# EAGLE design untitled (EAGLE 7.6.0)
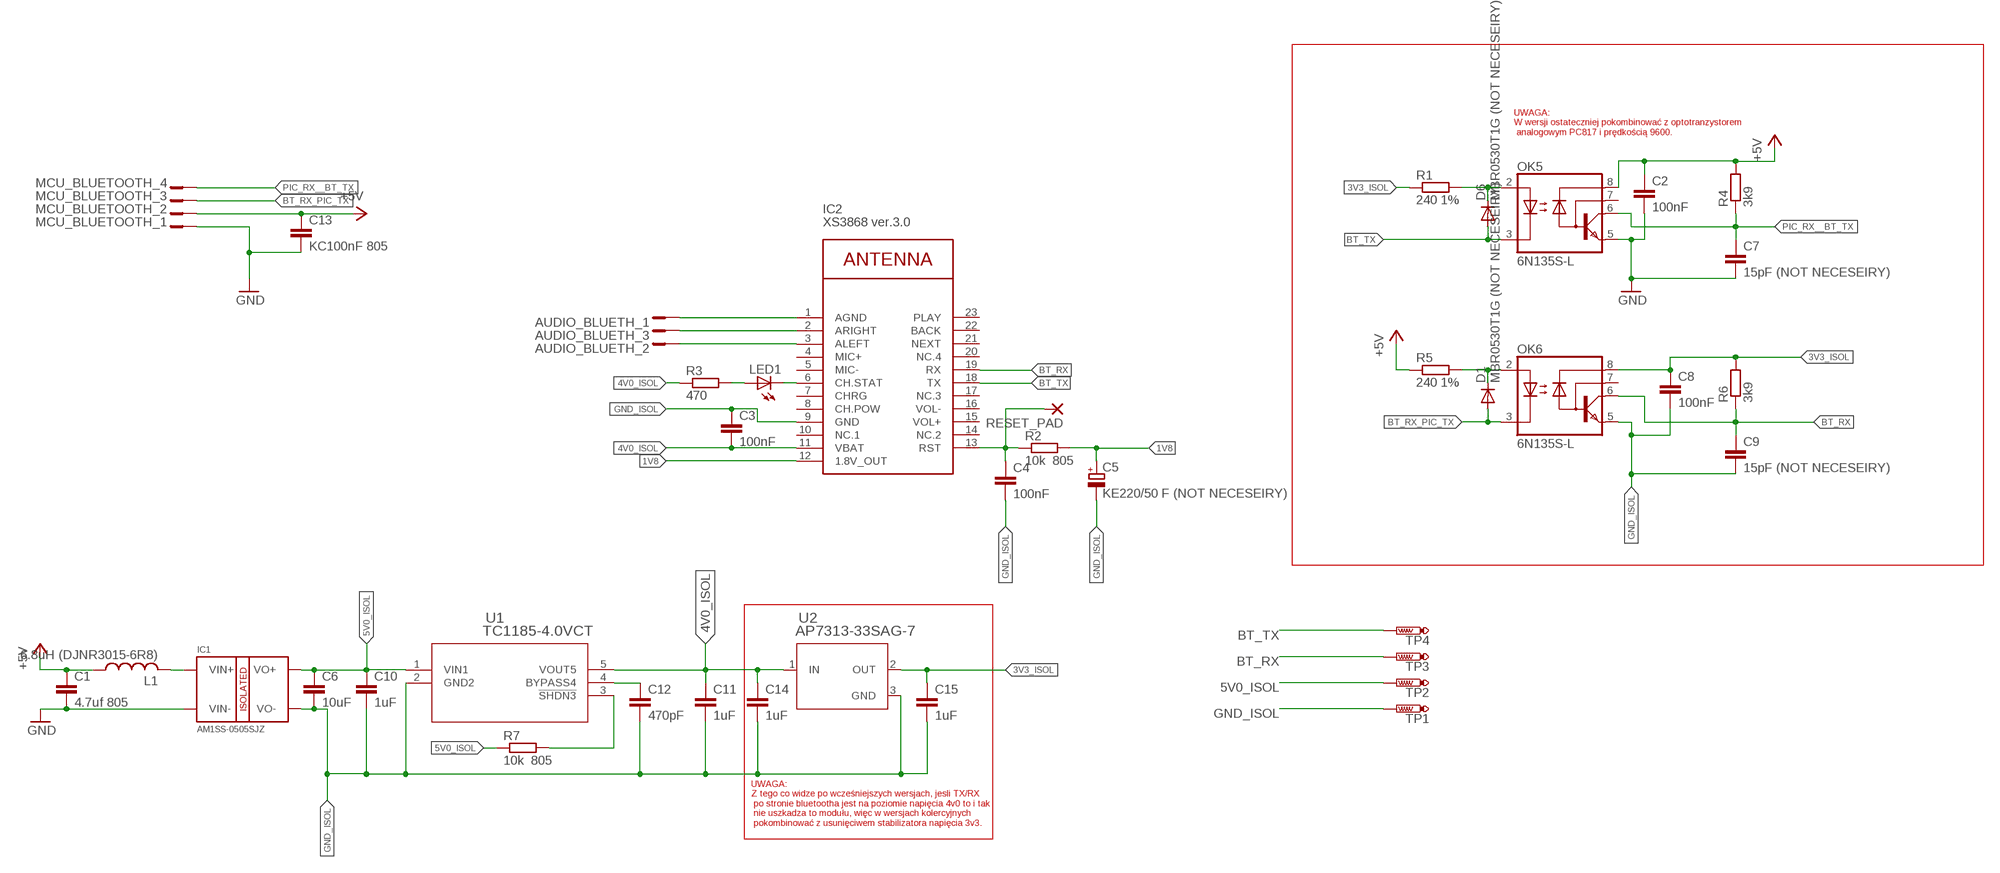
[diagram p0: schematic, sheet 1, part 1 of 2]
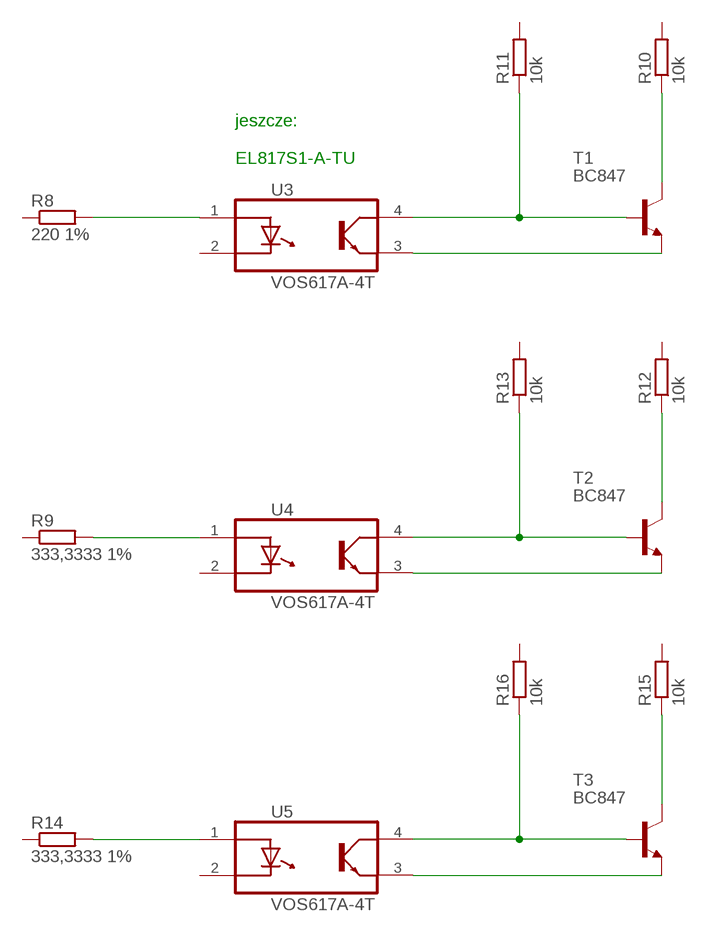
[diagram p1: schematic, sheet 1, part 2 of 2]

## Parts
AUDIO_BLUETH  JST_3_PIN_B3B-PH-KS  [B3B-PH-KS]
C1  4.7uf 805  C-EUC0805  [C0805]
C2  100nF  C-EUC0805  [C0805]
C3  100nF  C-EUC0805  [C0805]
C4  100nF  C-EUC0805  [C0805]
C5  KE220/50 F (NOT NECESEIRY)  CPOL-EUG  [PANASONIC_G]
C6  10uF  C-EUC0805  [C0805]
C7  15pF (NOT NECESEIRY)  C-EUC0805  [C0805]
C8  100nF  C-EUC0805  [C0805]
C9  15pF (NOT NECESEIRY)  C-EUC0805  [C0805]
C10  1uF  C-EUC0805  [C0805]
C11  1uF  C-EUC0805  [C0805]
C12  470pF  C-EUC0805  [C0805]
C13  KC100nF 805  C-EUC0805  [C0805]
C14  1uF  C-EUC0805  [C0805]
C15  1uF  C-EUC0805  [C0805]
D1  MBR0530T1G (NOT NECESEIRY)  MBR0520LT  [SOD123]
D6  MBR0530T1G (NOT NECESEIRY)  MBR0520LT  [SOD123]
IC1  AM1SS-0505SJZ  AM1SS-0503S-NZ  [SIP4]
IC2  XS3868 ver.3.0  WIRELESS-BLUETOOTH-XS3868  [WIRELESS-BLUETOOTH-XS3868]
L1  6.8uH (DJNR3015-6R8)  L-USL3230M  [L3230M]
LED1  LEDSMART-LED  [SMART-LED]
MCU_BLUETOOTH  JST_4_PIN_B4B-PH-KS  [B4B-PH-KS]
OK5  6N135S-L  6N135DIL8-SMD  [DIL8-SMD]
OK6  6N135S-L  6N135DIL8-SMD  [DIL8-SMD]
R1  240 1%  R-EU_M0805  [M0805]
R2  10k 805  R-EU_M0805  [M0805]
R3  470  R-EU_M0805  [M0805]
R4  3k9  R-EU_M0805  [M0805]
R5  240 1%  R-EU_M0805  [M0805]
R6  3k9  R-EU_M0805  [M0805]
R7  10k 805  R-EU_M0805  [M0805]
R8  220 1%  R-EU_M0805  [M0805]
R9  333,3333 1%  R-EU_M0805  [M0805]
R10  10k  R-EU_M0805  [M0805]
R11  10k  R-EU_M0805  [M0805]
R12  10k  R-EU_M0805  [M0805]
R13  10k  R-EU_M0805  [M0805]
R14  333,3333 1%  R-EU_M0805  [M0805]
R15  10k  R-EU_M0805  [M0805]
R16  10k  R-EU_M0805  [M0805]
RESET_PAD  SMD2  [SMD1,27-2,54]
T1  BC847  [SOT23]
T2  BC847  [SOT23]
T3  BC847  [SOT23]
TP1  PTR1B1,27  [B1,27]
TP2  PTR1B1,27  [B1,27]
TP3  PTR1B1,27  [B1,27]
TP4  PTR1B1,27  [B1,27]
U1  TC1185-4.0VCT  TC1185-X.XXCT713SOT-23-5_MC-M  [SOT-23-5_MC-M]
U2  AP7313-33SAG-7  [SOT-23]
U3  VOS617A-4T  [SOIC127P700X210-4N]
U4  VOS617A-4T  [SOIC127P700X210-4N]
U5  VOS617A-4T  [SOIC127P700X210-4N]

## Nets
1V8: C5.+ IC2.12(1.8V_OUT) R2.2
3V3_ISOL: C8.1 C15.1 OK6.8(VCC) R1.1 R6.2 U2.2(OUT)
4V0_ISOL: C3.2 C11.1 C14.1 IC2.11(VBAT) R3.1 U1.5(VOUT5) U2.1(IN)
5V0_ISOL: C6.1 C10.1 IC1.P$4(VO+) R7.1 TP2.TP U1.1(VIN1)
+5V: C1.1 C2.1 C13.1 L1.1 MCU_BLUETOOTH.P$2 OK5.8(VCC) R4.2 R5.1
AGND: AUDIO_BLUETH.P$1 IC2.1(AGND)
BT_LED: IC2.6(CH.STAT) LED1.B(C)
BT_RX: C9.1 IC2.19(RX) OK6.6(VO) R6.1 TP3.TP
BT_RX_PIC_TX: D1.A MCU_BLUETOOTH.P$3 OK6.3(C)
BT_TX: D6.A IC2.18(TX) OK5.3(C) TP4.TP
BTOUT_LEFT: AUDIO_BLUETH.P$2 IC2.3(ALEFT)
BTOUT_RIGHT: AUDIO_BLUETH.P$3 IC2.2(ARIGHT)
GND: C1.2 C2.2 C7.2 C13.2 IC1.P$1(VIN-) MCU_BLUETOOTH.P$1 OK5.5(GND)
GND_ISOL: C3.1 C4.2 C5.- C6.2 C8.2 C9.2 C10.2 C11.2 C12.2 C14.2 C15.2 IC1.P$3(VO-) IC2.9(GND) OK6.5(GND) TP1.TP U1.2(GND2) U2.3(GND)
N$1: IC1.P$2(VIN+) L1.2
N$2: D6.C OK5.2(A) R1.2
N$3: D1.C OK6.2(A) R5.2
N$4: C12.1 U1.4(BYPASS4)
N$5: LED1.A R3.2
N$6: R7.2 U1.3(!SHDN3)
N$7: R8.2 U3.1(A)
N$8: R9.2 U4.1(A)
N$9: R10.1 T1.3(C)
N$10: R11.1 T1.1(B) U3.4(CO)
N$11: T1.2(E) U3.3(E)
N$12: R12.1 T2.3(C)
N$13: R13.1 T2.1(B) U4.4(CO)
N$14: T2.2(E) U4.3(E)
N$15: R14.2 U5.1(A)
N$16: R15.1 T3.3(C)
N$17: R16.1 T3.1(B) U5.4(CO)
N$18: T3.2(E) U5.3(E)
PIC_RX__BT_TX: C7.1 MCU_BLUETOOTH.P$4 OK5.6(VO) R4.1
RST: C4.1 IC2.13(RST) R2.1 RESET_PAD.1(P)
Unconnected: IC2.4(MIC+) IC2.5(MIC-) IC2.7(CHRG) IC2.8(CH.POW) IC2.10(NC.1) IC2.14(NC.2) IC2.15(VOL+) IC2.16(VOL-) IC2.17(NC.3) IC2.20(NC.4) IC2.21(NEXT) IC2.22(BACK) IC2.23(PLAY) OK5.7(VB) OK6.7(VB) R8.1 R9.1 R10.2 R11.2 R12.2 R13.2 R14.1 R15.2 R16.2 U3.2(C) U4.2(C) U5.2(C)

## Notes on the sheet
- jeszcze:
  
  EL817S1-A-TU
- UWAGA:
  W wersji ostateczniej pokombinować z optotranzystorem
   analogowym PC817 i prędkością 9600.
- UWAGA:
  Z tego co widze po wcześniejszych wersjach, jesli TX/RX
   po stronie bluetootha jest na poziomie napięcia 4v0 to i tak
   nie uszkadza to modułu, więc w wersjach kolercyjnych
   pokombinować z usunięciwem stabilizatora napięcia 3v3.

## Library data of the parts
AUDIO_BLUETH = conn-JST:JST_3_PIN_
C1 C13 = rcl:C-EU: CAPACITOR, European symbol
C2-C4 C6-C12 C14 C15 = resistor:C-EU: CAPACITOR, European symbol
C5 = rcl:CPOL-EU: POLARIZED CAPACITOR, European symbol
D1 D6 = diode:MBR0520LT: SCHOTTKY BARRIER RECTIFIER Source: http://onsemi.com .. MBR0520LT1-D.pdf
IC1 = DC-DC_converter:AM1SS
IC2 = diy-modules:WIRELESS-BLUETOOTH-XS3868: Bluetooth Stereo Audio Module based on OVC3860 chip More details available here: http://artofcircuits.com/product/bluetooth-2-0-edr-stereo-audio-ovc3860-module-model-xs-3868 Click here to find device on ebay.com <http://www.ebay.com/sch/xs3868+bluetooth+audio+module>
L1 = rcl:L-US: INDUCTOR, American symbol
LED1 = led:LED: LED OSRAM: - CHIPLED LG R971, LG N971, LY N971, LG Q971, LY Q971, LO R971, LY R971 LH N974, LH R974 LS Q976, LO Q976, LY Q976 LO Q996 - Hyper CHIPLED LW Q18S LB Q993, LB Q99A, LB R99A - SideLED LS A670, LO A670, LY A670, LG A670, LP A670 LB A673, LV A673, LT A673, LW A673 LH A674 LY A675 LS A676, LA A676, LO A676, LY A676, LW A676 LS A679, LY A679, LG A679 - Hyper Micro SIDELED® LS Y876, LA Y876, LO Y876, LY Y876 LT Y87S - SmartLED LW L88C, LW L88S LB L89C, LB L89S, LG L890 LS L89K, LO L89K, LY L89K LS L896, LA L896, LO L896, LY L896 - TOPLED LS T670, LO T670, LY T670, LG T670, LP T670 LSG T670, LSP T670, LSY T670, LOP T670, LYG T670 LG T671, LOG T671, LSG T671 LB T673, LV T673, LT T673, LW T673 LH T674 LS T676, LA T676, LO T676, LY T676, LB T676, LH T676, LSB T676, LW T676 LB T67C, LV T67C, LT T67C, LS T67K, LO T67K, LY T67K, LW E67C LS E67B, LA E67B, LO E67B, LY E67B, LB E67C, LV E67C, LT E67C LW T67C LS T679, LY T679, LG T679 LS T770, LO T770, LY T770, LG T770, LP T770 LB T773, LV T773, LT T773, LW T773 LH T774 LS E675, LA E675, LY E675, LS T675 LS T776, LA T776, LO T776, LY T776, LB T776 LHGB T686 LT T68C, LB T68C - Hyper Mini TOPLED® LB M676 - Mini TOPLED Santana® LG M470 LS M47K, LO M47K, LY M47K Source: http://www.osram.convergy.de LUXEON: - LUMILED® LXK2-PW12-R00, LXK2-PW12-S00, LXK2-PW14-U00, LXK2-PW14-V00 LXK2-PM12-R00, LXK2-PM12-S00, LXK2-PM14-U00 LXK2-PE12-Q00, LXK2-PE12-R00, LXK2-PE12-S00, LXK2-PE14-T00, LXK2-PE14-U00 LXK2-PB12-K00, LXK2-PB12-L00, LXK2-PB12-M00, LXK2-PB14-N00, LXK2-PB14-P00, LXK2-PB14-Q00 LXK2-PR12-L00, LXK2-PR12-M00, LXK2-PR14-Q00, LXK2-PR14-R00 LXK2-PD12-Q00, LXK2-PD12-R00, LXK2-PD12-S00 LXK2-PH12-R00, LXK2-PH12-S00 LXK2-PL12-P00, LXK2-PL12-Q00, LXK2-PL12-R00 Source: www.luxeon.com KINGBRIGHT: KA-3528ASYC Source: www.kingbright.com
MCU_BLUETOOTH = conn-JST:JST_4_PIN_
OK5 OK6 = optocoupler:6N135: MOTOROLA OPTO COUPLER
R1-R16 = rcl:R-EU_: RESISTOR, European symbol
RESET_PAD = wirepad:SMD2: SMD PAD
T1-T3 = nxp_60:BC847: 45 V, 100 mA NPN general-purpose transistors NPN general-purpose transistor AAL Eindhoven MK
TP1-TP4 = testpad:PTR1: TEST PIN
U1 = TC1185:TC1185-X.XXCT713; MANUFACTURER_PART_NUMBER: TC1185X.XXCT713; VENDOR: Microchip
U2 = AP7313:AP7313-33SAG-7; MANUFACTURER_PART_NUMBER: AP731333SAG7; VENDOR: Diodes Inc
U3-U5 = VOS617A-4T:VOS617A-4T; DESCRIPTION: Optocoupler DC-IN 1-CH Transistor DC-OUT 4-Pin SSOP T/R; DIGI-KEY_PART_NUMBER: VOS617A-4TCT-ND; DIGI-KEY_PURCHASE_URL: https://www.digikey.pl/product-detail/en/vishay-semiconductor-opto-division/VOS617A-4T/VOS617A-4TCT-ND/6596775?utm_source=snapeda&utm_medium=aggregator&utm_campaign=symbol; MF: Vishay Semiconductor; MP: VOS617A-4T; PACKAGE: SSOP-4 Vishay

## Board
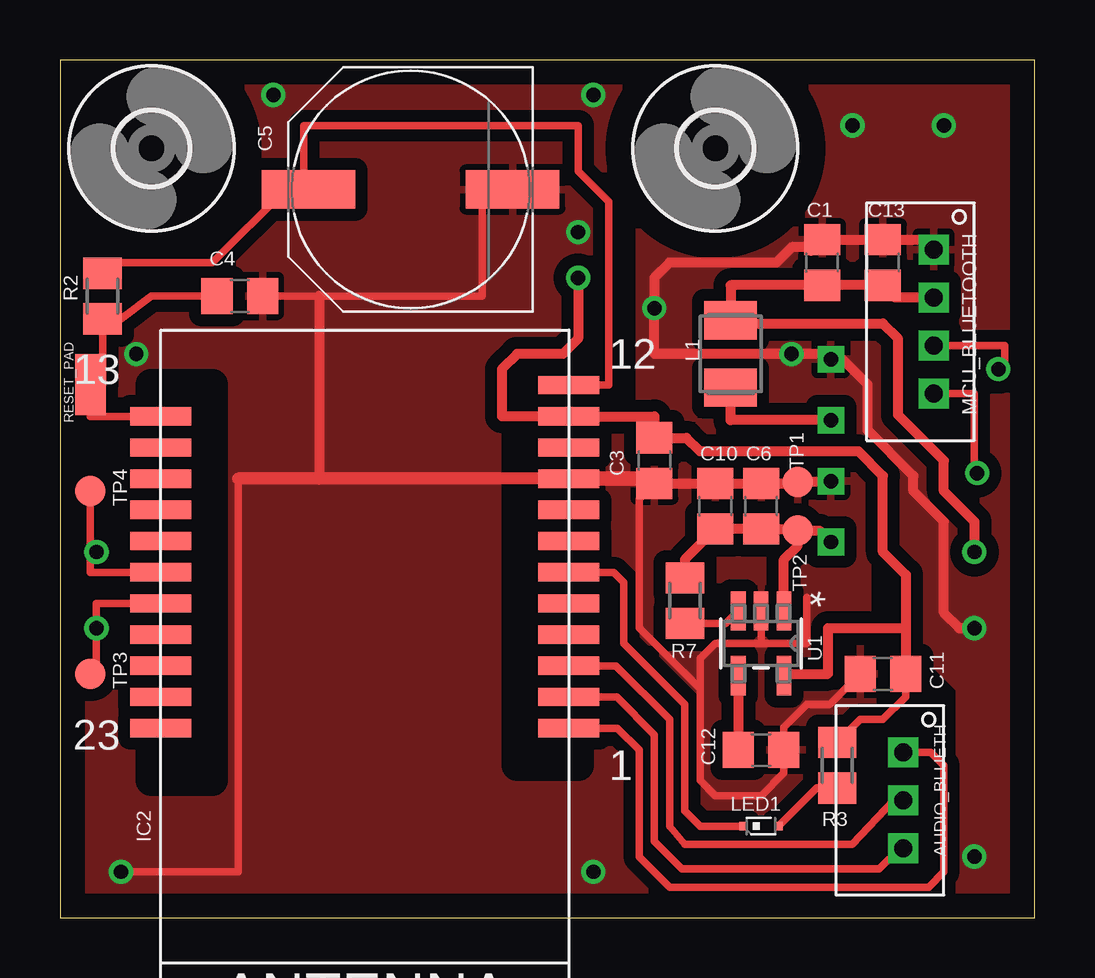
[diagram p2: board, top side]
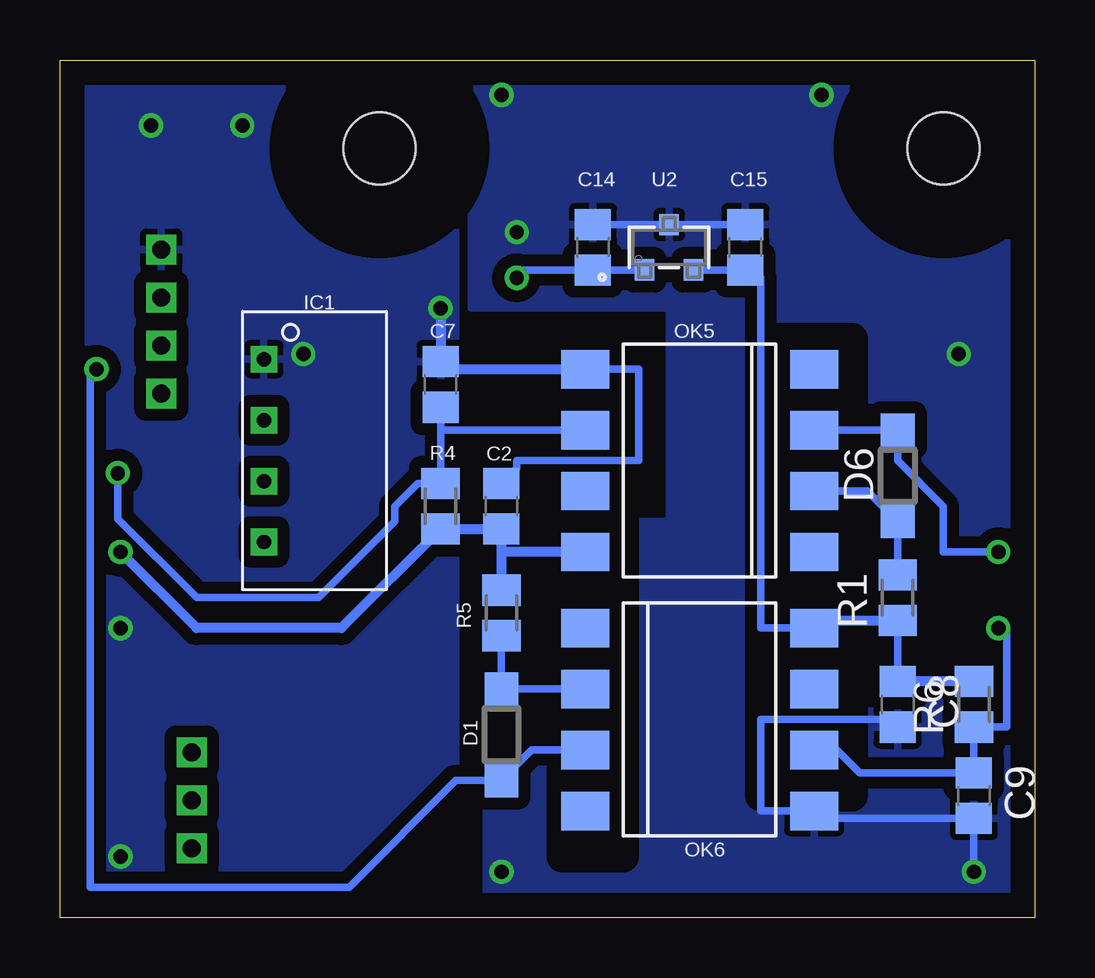
[diagram p3: board, bottom side, seen from below]

Size 40.62 x 35.75 mm. Coordinates in mm from the lower left corner, seen from the top.
Outline: 0,0 40.62,0 40.62,35.75 0,35.75 0,0
Copper layers (1*16): Top 0.035mm / dielectric 1.5mm / Bottom 0.035mm
Design rules "default": minimum track width 10mil, minimum drill 24mil, track to track 8mil, track to pad 8mil, pad to pad 8mil, via to via 8mil, smd to smd 8mil, copper to edge 40mil, drill to drill 8mil, minimum pad ring 10mil, minimum via ring 8mil, stop-mask expansion 4mil, vias tented up to drill 0mil, thermal gap 10mil
tRestrict: area 19.1,6.3 to 21.6,23.5; area 3.8,5.7 to 6.3,22.2
bRestrict: area 17.1,2.5 to 19.7,24.1; area 7.6,5.1 to 11.4,24.1

### Footprints (pad centres in the part's own frame; a part is rotated, then mirrored left to right if it is on the bottom)
B3B-PH-KS = drill 0.75 pad 1.2 square: P$1 -2,1.7; P$2 -4,1.7; P$3 -6,1.7
C0805 = smd 1.3 x 1.5: 1 -0.95,0; 2 0.95,0
PANASONIC_G = smd 3.9 x 1.6: + 4.25,0; - -4.25,0
SOD123 = smd 1.4 x 1.4: A 1.9,0; C -1.9,0
SIP4 = drill 0.6 square: P$1 -0.415,-2.91; P$2 2.125,-2.91; P$3 4.665,-2.91; P$4 7.205,-2.91
WIRELESS-BLUETOOTH-XS3868 = smd 2.54 x 0.762: 1 -8.5,0.995; 2 -8.5,-0.305; 3 -8.5,-1.605; 4 -8.5,-2.905; 5 -8.5,-4.205; 6 -8.5,-5.505; 7 -8.5,-6.805; 8 -8.5,-8.105; 9 -8.5,-9.405; 10 -8.5,-10.705; 11 -8.5,-12.005; 12 -8.5,-13.305; 13 8.5,-12.005; 14 8.5,-10.705; 15 8.5,-9.405; 16 8.5,-8.105; 17 8.5,-6.805; 18 8.5,-5.505; 19 8.5,-4.205; 20 8.5,-2.905; 21 8.5,-1.605; 22 8.5,-0.305; 23 8.5,0.995
L3230M = smd 1.6 x 2.2: 1 -1.4,0; 2 1.4,0
SMART-LED = smd 0.35 x 0.35: A 0,0.725; B 0,-0.725
B4B-PH-KS = drill 0.75 pad 1.2 square: P$1 -2,1.7; P$2 -4,1.7; P$3 -6,1.7; P$4 -8,1.7
DIL8-SMD = smd 1.6 x 2: 1 -3.81,-4.77; 2 -1.27,-4.77; 3 1.27,-4.77; 4 3.81,-4.77; 5 3.81,4.77; 6 1.27,4.77; 7 -1.27,4.77; 8 -3.81,4.77
M0805 = smd 1.3 x 1.6: 1 -0.95,0; 2 0.95,0
SMD1,27-2,54 = smd 1.27 x 2.54: 1 0,0
SOT23 = smd 1 x 1.4: 1 -0.95,-1.1; 2 0.95,-1.1; 3 0,1.1
B1,27 = smd 1.27 x 1.27: TP 0,0
SOT-23-5_MC-M = smd 1.626 x 0.61: 1 -1.346,0.95; 2 -1.346,0; 3 -1.346,-0.95; 4 1.346,-0.95; 5 1.346,0.95
SOT-23 = smd 0.813 x 0.889: 1 -1.025,-0.945; 2 1.025,-0.945; 3 0,0.945
SOIC127P700X210-4N = smd 1.84 x 0.64: 1 -3.085,0.635; 2 -3.085,-0.635; 3 3.085,-0.635; 4 3.085,0.635
3,0 = hole 3: 0,0

### Placement (x,y rotation side)
AUDIO_BLUETH  36.83,8.89 90 top
C1  31.75,27.3 90 top
C2  22.22,17.14 90 bottom
C3  24.77,19.05 90 top
C4  7.49,25.91 0 top
C5  14.61,30.35 180 top
C6  29.21,17.14 90 top
C7  24.77,22.22 90 bottom
C8  5.71,8.89 270 bottom
C9  2.54,5.08 270 bottom
C10  27.3,17.14 90 top
C11  34.29,10.16 180 top
C12  29.21,6.98 0 top
C13  34.29,27.3 90 top
C14  18.41,27.94 90 bottom
C15  12.06,27.94 90 bottom
D1  22.22,7.62 270 bottom
D6  5.71,18.41 90 bottom
IC1  29.21,22.86 270 bottom
IC2  12.7,8.89 180 top
L1  27.94,23.49 270 top
LED1  29.21,3.81 270 top
MCU_BLUETOOTH  38.1,29.84 90 top
OK5  13.97,19.05 90 bottom
OK6  13.97,8.25 270 bottom
R1  5.71,13.34 90 bottom
R2  1.78,25.91 90 top
R3  32.38,6.35 270 top
R4  24.77,17.14 270 bottom
R5  22.22,12.7 270 bottom
R6  2.54,8.89 90 bottom
R7  26.03,13.21 270 top
R8  -1.27,-46.99 0 top  (outside the outline)
R9  -1.27,-53.34 0 top  (outside the outline)
R10  -1.27,-59.69 0 top  (outside the outline)
R11  -1.27,-66.04 0 top  (outside the outline)
R12  -1.27,-81.28 0 top  (outside the outline)
R13  3.81,-81.28 0 top  (outside the outline)
R14  -1.27,-104.14 0 top  (outside the outline)
R15  -1.27,-110.49 0 top  (outside the outline)
R16  3.81,-110.49 0 top  (outside the outline)
RESET_PAD  1.27,22.22 180 top
T1  -2.54,-39.37 0 top  (outside the outline)
T2  -2.54,-73.66 0 top  (outside the outline)
T3  -2.54,-96.52 0 top  (outside the outline)
TP1  30.73,18.16 0 top
TP2  30.73,16.13 0 top
TP3  1.27,10.16 0 top
TP4  1.27,17.78 0 top
U1  29.21,11.43 270 top
U2  15.24,27.94 0 bottom
U3  2.54,-24.13 0 top  (outside the outline)
U4  2.54,-31.75 0 top  (outside the outline)
U5  2.54,-88.9 0 top  (outside the outline)
U$2  [3,0]  3.81,32.07 0 top
U$3  [3,0]  27.3,32.07 0 top

### Tracks (layer width: path | path; a pad name or v marks a point on that pad's centre or on a via)
1V8
  Top 0.305: IC2.12 22.86,22.2 22.86,29.84 21.59,31.12 21.59,33.02 10.16,33.02 10.16,30.79 C5.+ 9.4,30.35 6.35,27.3 1.78,27.3 R2.2
3V3_ISOL
  Bottom 0.254: OK6.8 8.88,12.38
  Bottom 0.305: OK6.8 11.43,12.06 11.43,26.67 11.75,26.99 C15.1 U2.2 | C8.1 R1.1
  Bottom 0.406: R6.2 C8.1 | 8.88,12.38 R1.1
4V0_ISOL  (via drill 0.6)
  Top 0.305: R3.1 33.34,8.25 34.29,8.25 35.24,9.2 C11.1
  Top 0.406: v21.59,26.67 21.59,24.13 20.95,23.49 19.05,23.49 18.41,22.86 18.41,20.89 IC2.11 24.77,20.89 C3.2 26.1,20 26.67,19.43 33.27,19.43 34.29,18.41 34.29,15.24 35.24,14.29 35.24,12.06 | 35.24,12.06 C11.1 | U1.5 30.24,10.16 32,10.16 32,12.06 35.24,12.06
  Bottom 0.305: v21.59,26.67 21.27,26.99 C14.1 U2.1
5V0_ISOL
  Top 0.406: TP2.TP 30.67,16.2 C6.1 C10.1 26.03,14.93 R7.1 | TP2.TP 31.65,16.13 IC1.P$4 | U1.1 30.16,14.92 30.73,15.49 TP2.TP
+5V  (via drill 0.6)
  Top 0.406: MCU_BLUETOOTH.P$2 34.8,25.84 C13.1 C1.1 27.94,26.35 L1.1 27.94,24.77 34.29,24.77 34.92,24.13 34.92,20.95 36.83,19.05 36.83,17.78 38.1,16.51 v38.1,15.24
  Bottom 0.406: 22.22,15.24 C2.1 R4.2 28.89,12.06 34.92,12.06 v38.1,15.24 | 22.22,15.24 R5.1 | OK5.8 22.22,15.24
AGND
  Top 0.305: AUDIO_BLUETH.P$1 36.29,6.89 36.83,6.35 36.83,1.9 36.2,1.27 25.4,1.27 24.13,2.54 24.13,6.98 23.22,7.89 IC2.1
BT_LED
  Top 0.305: IC2.6 23.07,14.39 23.49,13.97 23.49,11.43 26.03,8.89 26.03,4.45 26.67,3.81 LED1.B
BT_RX  (via drill 0.6)
  Top 0.305: IC2.19 1.52,13.09 v1.52,12.06 1.52,10.41 TP3.TP
  Bottom 0.305: OK6.6 8.25,6.98 7.3,6.03 C9.1 R6.1 1.17,7.94 1.17,12.06 v1.52,12.06
BT_RX_PIC_TX  (via drill 0.6)
  Top 0.305: MCU_BLUETOOTH.P$3 39.37,23.84 39.37,22.86 v39.1,22.86
  Bottom 0.305: OK6.3 20.96,6.98 D1.A 24.12,5.72 28.58,1.27 39.37,1.27 39.37,22.59 arc90 v39.1,22.86
BT_TX  (via drill 0.6)
  Top 0.305: IC2.18 1.27,14.39 1.27,15.24 | 1.27,15.24 v1.52,15.24 | TP4.TP 1.27,15.24
  Bottom 0.305: OK5.3 D6.A 5.71,19.05 3.81,17.14 3.81,15.24 v1.52,15.24
BTOUT_LEFT
  Top 0.305: IC2.3 23.16,10.5 25.4,8.25 25.4,3.81 26.03,3.05 33.02,3.05 34.73,4.89 AUDIO_BLUETH.P$2
BTOUT_RIGHT
  Top 0.305: IC2.2 23.19,9.2 24.77,7.62 24.77,3.17 25.91,2.03 34.14,2.03 35,2.89 AUDIO_BLUETH.P$3
GND  (via drill 0.6)
  Top 0.406: MCU_BLUETOOTH.P$1 35.99,28.26 C13.2 C1.2 | v38.1,12.06 37.46,12.06 36.83,12.7 36.83,16.51 35.56,17.78 35.56,18.41 33.66,20.32 33.66,22.22 32.38,23.49 31.9,23.49 | C1.2 31.3,27.8 | IC1.P$1 31.9,23.49 | 31.9,23.49 24.77,23.49 v24.77,25.4 24.77,26.67 25.4,27.3 29.84,27.3 30.48,27.94 31.44,27.94 C1.2
  Bottom 0.305: C2.2 21.59,18.73 21.59,19.05 16.51,19.05 16.51,22.86 OK5.5
  Bottom 0.406: OK5.5 25.09,22.86 C7.2 v24.77,25.4
  other vias: 36.83,33.02 33.02,33.02 38.1,2.54 30.48,23.49
  pour Top (isolate 0.508): 24.13,38.1 43.18,38.1 43.18,-1.27 37.46,-1.27 37.46,9.52 34.29,12.7 34.29,19.68 24.13,19.68
  pour Bottom (isolate 0.508): 41.91,-1.27 24.13,-1.27 24.13,36.83 41.91,36.83
GND_ISOL  (via drill 0.6)
  Top 0.305: C4.2 10.79,25.91 17.59,25.91 17.59,30.35 C5.- | 7.43,18.29 7.43,1.9 v2.54,1.9 | C10.2 C3.1 24.13,17.45 24.13,12.06 26.67,9.52 | 26.67,9.52 26.67,5.71 27.3,5.08 29.21,5.08 30.16,6.03 C12.2 30.16,7.93 31.12,8.89 32.07,8.89 C11.2 | 26.67,9.52 26.67,10.79 27.3,11.43 29.21,11.43 | 31.12,13.34 31.12,11.43 29.21,11.43 | U1.2 29.21,11.43
  Top 0.406: 10.79,25.91 10.79,18.29 | C3.1 C6.2 30.67,18.09 TP1.TP 32.09,18.16 IC1.P$3
  Top 0.508: IC2.9 10.79,18.29 7.43,18.29
  Top 0.61: IC2.9 24.77,18.29 C3.1
  Bottom 0.305: C8.2 arc-90 6.03,8.25 11.43,8.25 11.43,4.45 OK6.5 8.88,4.13 C9.2 v2.54,1.9 | C14.2 U2.3 C15.2
  other vias: 21.59,28.58 3.17,23.49 8.89,34.29 22.22,34.29 22.22,1.9
  pour Top (isolate 0.508): -3.81,-3.18 -3.81,38.1 23.49,38.1 23.49,19.05 33.66,19.05 33.66,12.06 36.83,8.89 36.83,-3.18
  pour Bottom (isolate 0.508): -2.54,-1.91 -2.54,36.83 23.49,36.83 23.49,25.4 15.24,25.4 15.24,16.51 25.4,16.51 25.4,15.24 22.86,15.24 22.86,-1.91
N$1
  Top 0.406: IC1.P$2 27.94,20.73 L1.2
N$2
  Bottom 0.305: OK5.2 6.98,17.78 D6.C R1.2
N$3
  Bottom 0.305: OK6.2 D1.C R5.2
N$4
  Top 0.406: U1.4 C12.1
N$5
  Top 0.305: LED1.A 31.52,5.4 R3.2
N$6
  Top 0.305: R7.2 27.74,12.26 U1.3
N$7  (1 unrouted)
N$8  (1 unrouted)
N$9  (1 unrouted)
N$10  (2 unrouted)
N$11  (1 unrouted)
N$12  (1 unrouted)
N$13  (2 unrouted)
N$14  (1 unrouted)
N$15  (1 unrouted)
N$16  (1 unrouted)
N$17  (2 unrouted)
N$18  (1 unrouted)
PIC_RX__BT_TX  (via drill 0.6)
  Top 0.305: MCU_BLUETOOTH.P$4 38.1,21.84 38.1,18.64 v38.21,18.53
  Bottom 0.305: C7.1 24.77,20.32 | 24.77,20.32 R4.1 25.72,18.09 26.67,17.14 26.67,16.51 29.84,13.34 34.92,13.34 38.21,16.62 v38.21,18.53 | OK5.6 24.77,20.32
RST
  Top 0.305: C4.1 3.81,25.91 2.54,24.96 R2.1 1.78,22.22 RESET_PAD.1 1.27,20.89 IC2.13